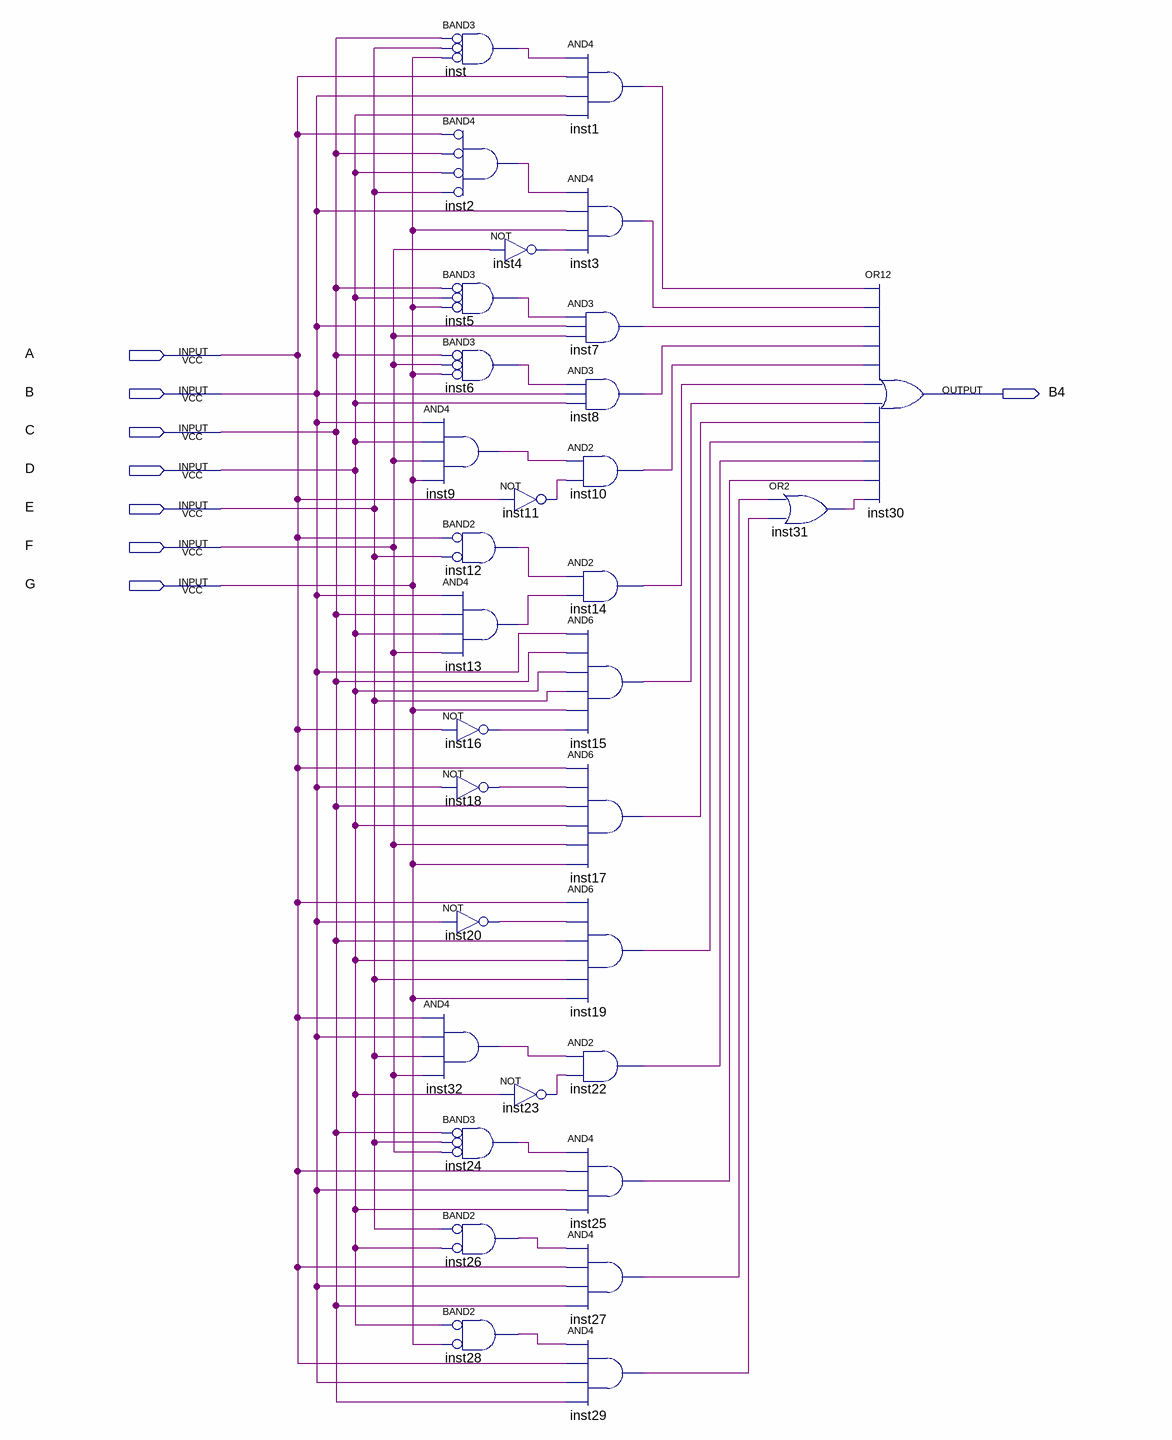
[diagram p0: schematic sheet]
// Quartus schematic posicao2.bdf as structural Verilog: 32 symbols, 8 pins
module posicao2 (
  input  A,
  input  B,
  input  C,
  input  D,
  input  E,
  input  F,
  input  G,
  output B4
);

  wire inst1_out, inst2_out, inst3_out, inst4_out, inst5_out, inst6_out, inst7_out, inst8_out, inst9_out,
       inst10_out, inst11_out, inst12_out, inst13_out, inst14_out, inst15_out, inst16_out, inst17_out,
       inst18_out, inst19_out, inst20_out, inst22_out, inst23_out, inst24_out, inst25_out, inst26_out,
       inst27_out, inst28_out, inst29_out, inst31_out, inst32_out, inst_out;

  and inst (inst_out, ~C, ~E, ~G);  // BAND3
  and inst2 (inst2_out, ~A, ~C, ~D, ~E);  // BAND4
  not inst4 (inst4_out, F);
  and inst5 (inst5_out, ~C, ~D, ~G);  // BAND3
  and inst6 (inst6_out, ~C, ~F, ~G);  // BAND3
  and inst9 (inst9_out, B, D, F, G);
  and inst12 (inst12_out, ~A, ~E);  // BAND2
  and inst13 (inst13_out, B, C, D, F);
  not inst16 (inst16_out, A);
  not inst18 (inst18_out, B);
  not inst20 (inst20_out, B);
  and inst32 (inst32_out, A, B, E, F);
  and inst24 (inst24_out, ~C, ~E, ~F);  // BAND3
  and inst26 (inst26_out, ~E, ~D);  // BAND2
  and inst28 (inst28_out, ~D, ~G);  // BAND2
  and inst1 (inst1_out, inst_out, A, B, D);
  and inst3 (inst3_out, inst2_out, B, G, inst4_out);
  and inst7 (inst7_out, inst5_out, B, F);
  and inst8 (inst8_out, inst6_out, B, D);
  and inst10 (inst10_out, inst9_out, inst11_out);
  not inst11 (inst11_out, A);
  and inst14 (inst14_out, inst12_out, inst13_out);
  and inst15 (inst15_out, B, C, D, E, G, inst16_out);
  and inst17 (inst17_out, A, inst18_out, C, D, F, G);
  and inst19 (inst19_out, A, inst20_out, C, D, E, G);
  and inst22 (inst22_out, inst32_out, inst23_out);
  not inst23 (inst23_out, D);
  and inst25 (inst25_out, inst24_out, A, B, D);
  and inst27 (inst27_out, inst26_out, A, B, C);
  and inst29 (inst29_out, inst28_out, A, B, C);
  or inst31 (inst31_out, inst27_out, inst29_out);
  or inst30 (B4, inst1_out, inst3_out, inst7_out, inst8_out, inst10_out, inst14_out, inst15_out, inst17_out, inst19_out, inst22_out, inst25_out, inst31_out);
endmodule
